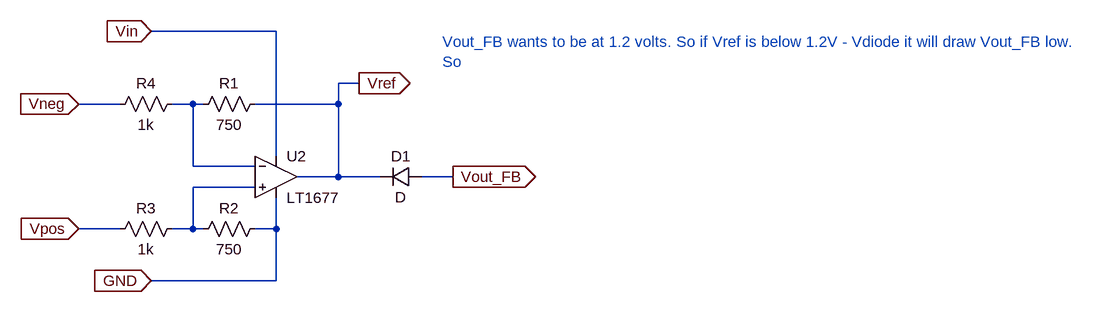
[diagram p0: schematic Stage_2_active_feedback.asc]
Stage_2_active_feedback.asc, the LTspice schematic file:
Version 4
SHEET 1 2164 776
WIRE 528 -560 336 -560
WIRE 656 -480 624 -480
WIRE 288 -448 224 -448
WIRE 400 -448 368 -448
WIRE 416 -448 400 -448
WIRE 624 -448 624 -480
WIRE 624 -448 496 -448
WIRE 528 -368 528 -560
WIRE 400 -352 400 -448
WIRE 496 -352 400 -352
WIRE 624 -336 624 -448
WIRE 624 -336 560 -336
WIRE 688 -336 624 -336
WIRE 800 -336 752 -336
WIRE 496 -320 400 -320
WIRE 288 -256 224 -256
WIRE 400 -256 400 -320
WIRE 400 -256 368 -256
WIRE 416 -256 400 -256
WIRE 528 -256 528 -304
WIRE 528 -256 496 -256
WIRE 528 -176 528 -256
WIRE 528 -176 336 -176
FLAG 336 -560 Vin
IOPIN 336 -560 In
FLAG 336 -176 GND
IOPIN 336 -176 In
FLAG 224 -448 Vneg
IOPIN 224 -448 In
FLAG 224 -256 Vpos
IOPIN 224 -256 In
FLAG 800 -336 Vout_FB
IOPIN 800 -336 Out
FLAG 656 -480 Vref
IOPIN 656 -480 Out
SYMBOL res 512 -464 R90
WINDOW 0 0 56 VBottom 2
WINDOW 3 32 56 VTop 2
SYMATTR InstName R1
SYMATTR Value 750
SYMBOL res 512 -272 R90
WINDOW 0 0 56 VBottom 2
WINDOW 3 32 56 VTop 2
SYMATTR InstName R2
SYMATTR Value 750
SYMBOL res 384 -272 R90
WINDOW 0 0 56 VBottom 2
WINDOW 3 32 56 VTop 2
SYMATTR InstName R3
SYMATTR Value 1k
SYMBOL res 384 -464 R90
WINDOW 0 0 56 VBottom 2
WINDOW 3 32 56 VTop 2
SYMATTR InstName R4
SYMATTR Value 1k
SYMBOL OpAmps\\LT1677 528 -400 R0
SYMATTR InstName U2
SYMBOL diode 752 -352 R90
WINDOW 0 0 32 VBottom 2
WINDOW 3 32 32 VTop 2
SYMATTR InstName D1
TEXT 784 -544 Left 2 ;Vout_FB wants to be at 1.2 volts. So if Vref is below 1.2V - Vdiode it will draw Vout_FB low. \nSo

The netlist it stands for:
* Stage_2_active_feedback.asc
R1 Vref N001 750
R2 GND N002 750
R3 N002 Vpos 1k
R4 N001 Vneg 1k
XU2 N002 N001 Vin GND Vref LT1677  ; pins In+ In- V+ V- OUT
D1 Vout_FB Vref D
.model D D
.lib standard.dio
* Vout_FB wants to be at 1.2 volts. So if Vref is below 1.2V - Vdiode it will draw Vout_FB low.
* So
.lib LTC.lib
.backanno
.end